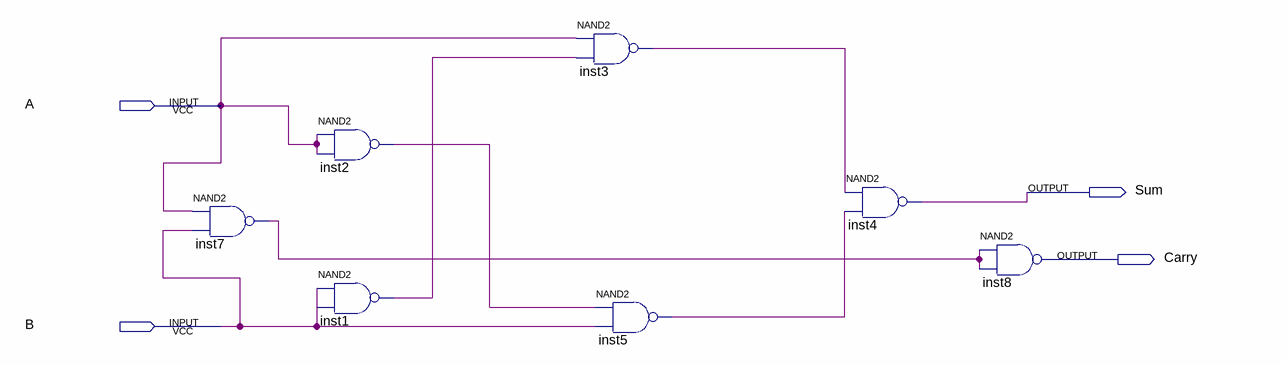
[diagram p0: schematic sheet]
// Quartus schematic halfadd.bdf as structural Verilog: 7 symbols, 4 pins
module halfadd (
  input  A,
  input  B,
  output Sum,
  output Carry
);

  wire inst1_out, inst2_out, inst3_out, inst5_out, inst7_out;

  nand inst7 (inst7_out, A, B);
  nand inst2 (inst2_out, A, A);
  nand inst1 (inst1_out, B, B);
  nand inst3 (inst3_out, A, inst1_out);
  nand inst5 (inst5_out, inst2_out, B);
  nand inst4 (Sum, inst3_out, inst5_out);
  nand inst8 (Carry, inst7_out, inst7_out);
endmodule
